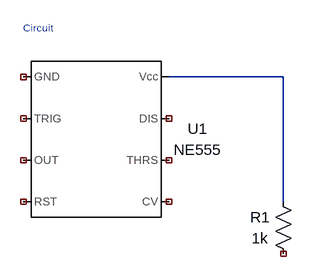
[diagram p0: schematic circuit.asc]
circuit.asc, the LTspice schematic file:
Version 4
SHEET 1 480 432
SYMBOL res 720 416 R0
WINDOW 0 -20 40 Center 2
WINDOW 3 -20 72 Center 2
SYMATTR InstName R1
SYMATTR Value 1k
SYMBOL Misc\NE555 448 336 R0
WINDOW 0 156 -16 Center 2
WINDOW 3 156 16 Center 2
SYMATTR InstName U1
SYMATTR Value NE555
WIRE 560 240 736 240
WIRE 736 240 736 432
TEXT 336 164 Left 1 ;Circuit

The netlist it stands for:
* circuit.asc
R1 N001 NC_01 1k
XU1 NC_02 NC_03 NC_04 NC_05 NC_06 NC_07 NC_08 N001 NE555  ; pins GND TRIG OUT RST CV THRS DIS Vcc
* Circuit
.lib NE555.sub
.backanno
.end